# Altium schematic sheet Sheet1.SchDoc
size A4; SheetNumber: 8; SheetTotal: 8
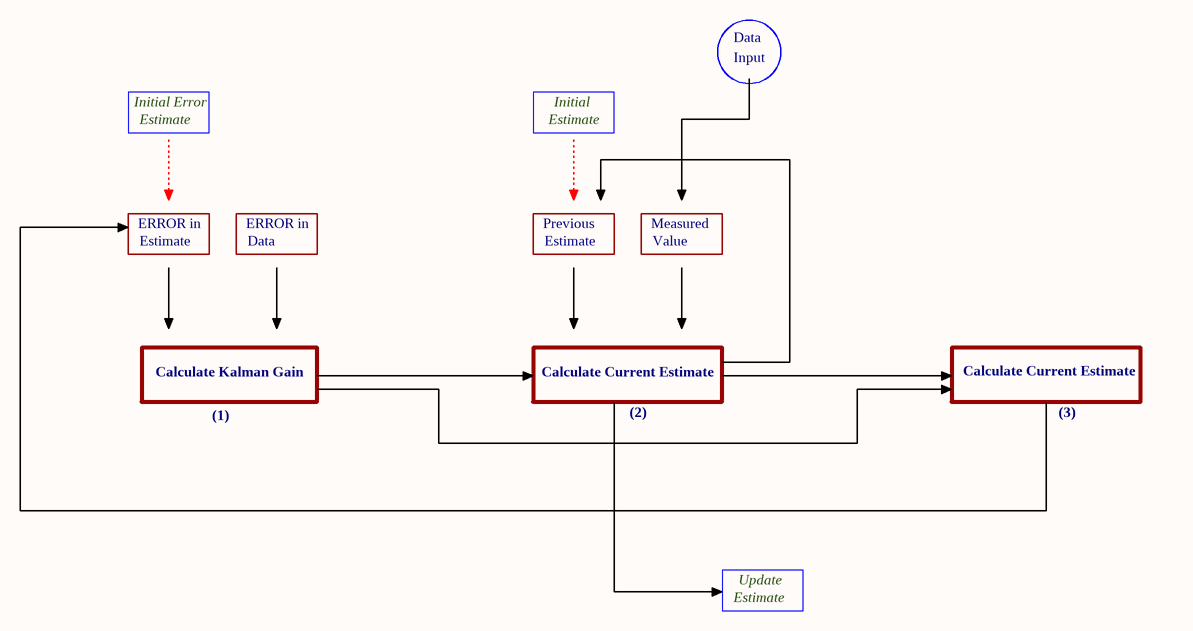
[diagram p0: Sheet1.SchDoc]

## Notes on the sheet
- Data
- Input
- Initial Error
- Estimate
- Initial
- ERROR in
- Previous
- Measured
- Value
- Calculate Kalman Gain
- Calculate Current Estimate
- (2)
- (3)
- (1)
- Update